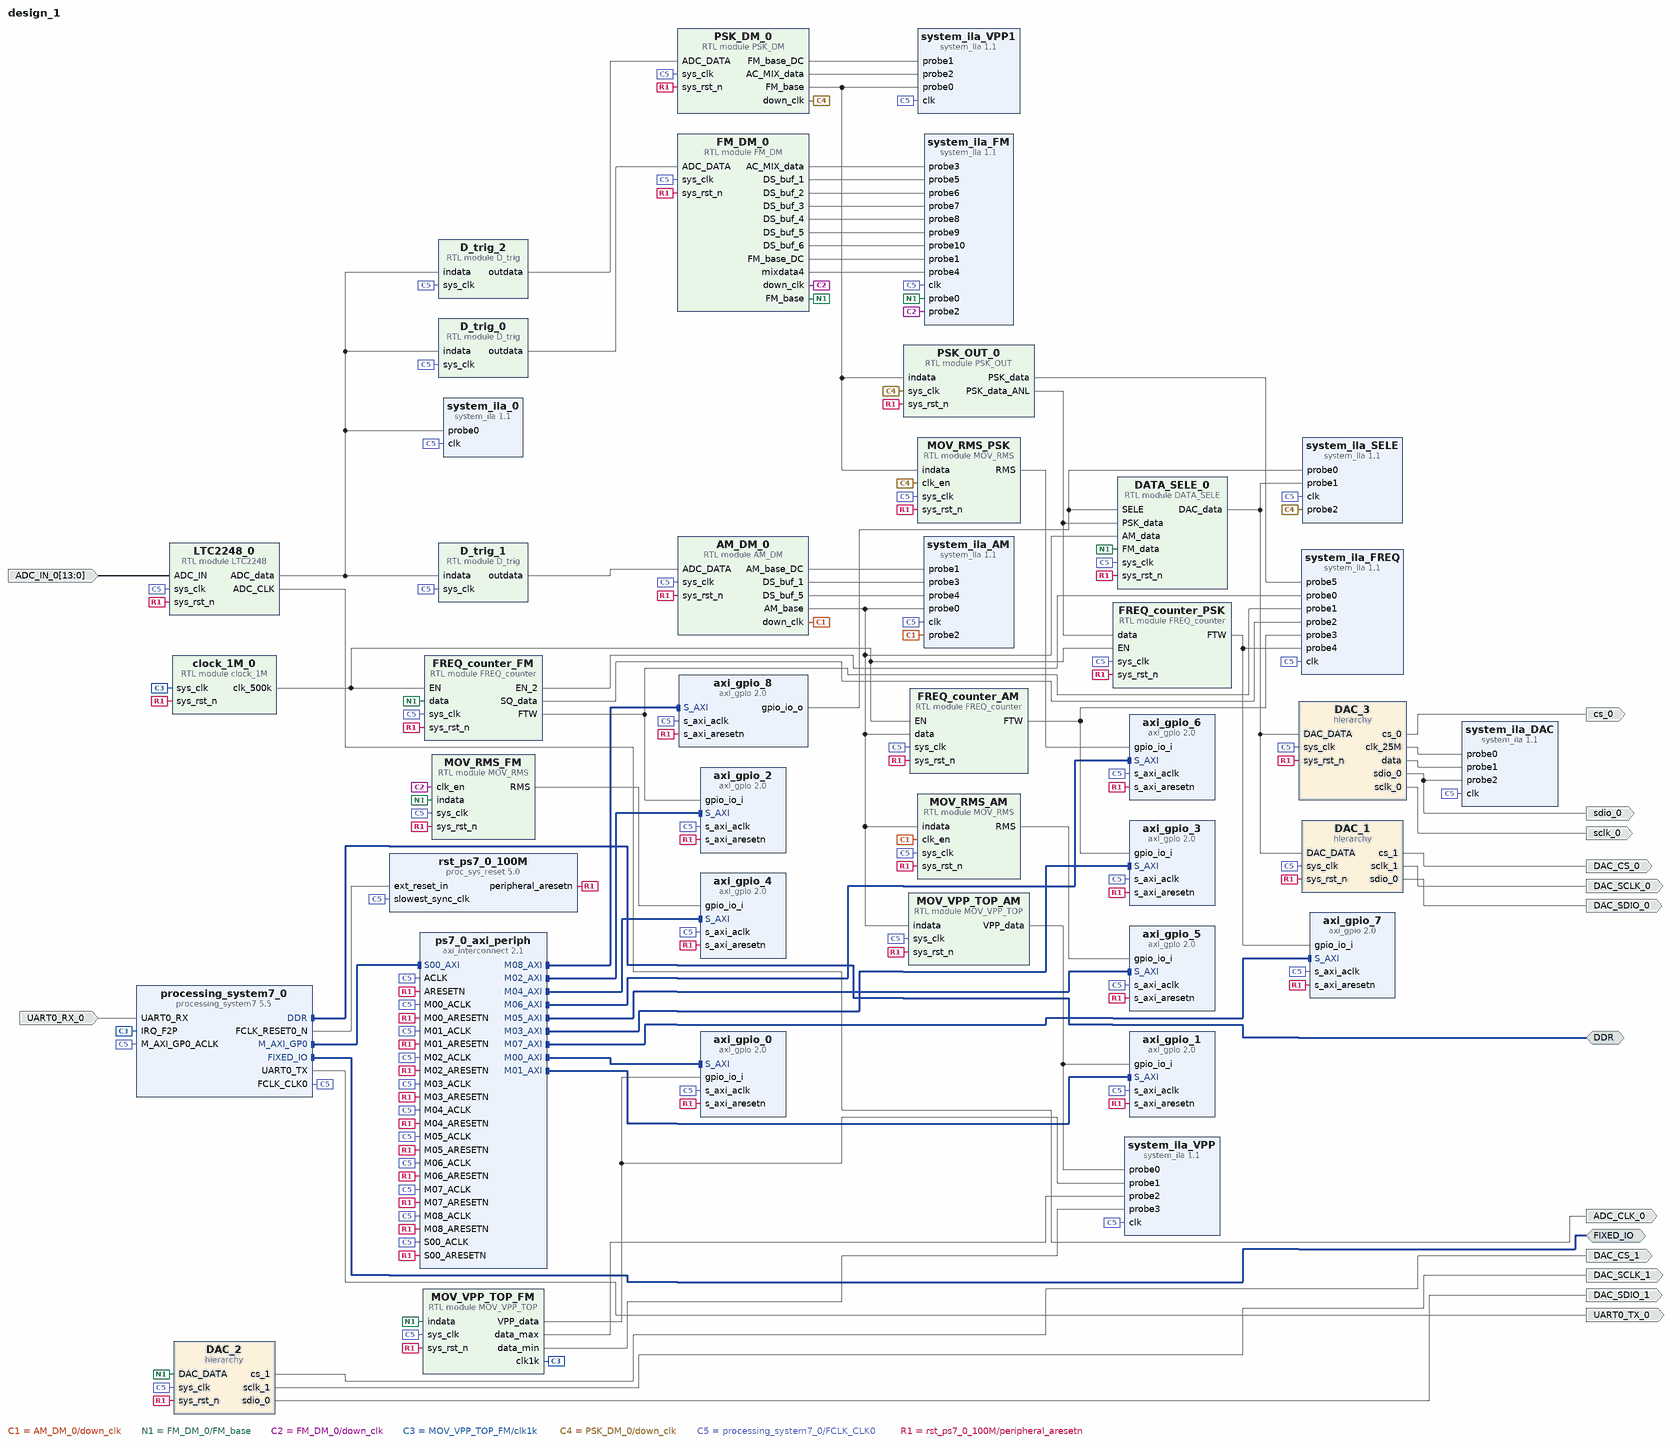
[diagram p0: block diagram of the top level]
# Vivado block design design_1, xc7z035ffg676-2, Vivado 2022.1
create_bd_design design_1

create_bd_intf_port -mode Master -vlnv xilinx.com:interface:ddrx_rtl:1.0 DDR
create_bd_intf_port -mode Master -vlnv xilinx.com:display_processing_system7:fixedio_rtl:1.0 FIXED_IO
create_bd_port -dir O UART0_TX_0
create_bd_port -dir I UART0_RX_0
create_bd_port -dir O DAC_SCLK_0
create_bd_port -dir O DAC_SDIO_0
create_bd_port -dir O DAC_CS_0
create_bd_port -dir O DAC_SCLK_1
create_bd_port -dir O DAC_SDIO_1
create_bd_port -dir O DAC_CS_1
create_bd_port -dir I -from 13 -to 0 ADC_IN_0
create_bd_port -dir O -type clk ADC_CLK_0
create_bd_port -dir O cs_0
create_bd_port -dir O sdio_0
create_bd_port -dir O sclk_0

create_bd_cell -type ip -vlnv xilinx.com:ip:processing_system7:5.5 processing_system7_0
set_property -dict [list \
  CONFIG.PCW_FPGA0_PERIPHERAL_FREQMHZ 100 \
  CONFIG.PCW_IRQ_F2P_INTR 1 \
  CONFIG.PCW_PRESET_BANK1_VOLTAGE {LVCMOS 1.8V} \
  CONFIG.PCW_QSPI_GRP_FBCLK_ENABLE 1 \
  CONFIG.PCW_QSPI_GRP_FBCLK_IO {MIO 8} \
  CONFIG.PCW_QSPI_GRP_SINGLE_SS_ENABLE 1 \
  CONFIG.PCW_QSPI_GRP_SINGLE_SS_IO {MIO 1 .. 6} \
  CONFIG.PCW_QSPI_PERIPHERAL_ENABLE 1 \
  CONFIG.PCW_QSPI_PERIPHERAL_FREQMHZ 125 \
  CONFIG.PCW_QSPI_QSPI_IO {MIO 1 .. 6} \
  CONFIG.PCW_SD0_GRP_CD_ENABLE 1 \
  CONFIG.PCW_SD0_GRP_CD_IO {MIO 47} \
  CONFIG.PCW_SD0_GRP_WP_ENABLE 0 \
  CONFIG.PCW_SD0_PERIPHERAL_ENABLE 1 \
  CONFIG.PCW_SD0_SD0_IO {MIO 40 .. 45} \
  CONFIG.PCW_SDIO_PERIPHERAL_FREQMHZ 50 \
  CONFIG.PCW_SINGLE_QSPI_DATA_MODE x4 \
  CONFIG.PCW_UART0_PERIPHERAL_ENABLE 1 \
  CONFIG.PCW_UART0_UART0_IO EMIO \
  CONFIG.PCW_UART1_PERIPHERAL_ENABLE 0 \
  CONFIG.PCW_UART_PERIPHERAL_FREQMHZ 100 \
  CONFIG.PCW_UIPARAM_DDR_PARTNO {MT41K256M16 RE-125} \
  CONFIG.PCW_USE_FABRIC_INTERRUPT 1 \
] [get_bd_cells processing_system7_0]
# 82 more settings of processing_system7_0 are not shown: defaults, MIO pin electricals, DDR timing, and values the tool derives
create_bd_cell -type ip -vlnv xilinx.com:ip:axi_gpio:2.0 axi_gpio_0
set_property -dict {CONFIG.C_ALL_INPUTS 1 CONFIG.C_GPIO_WIDTH 16} [get_bd_cells axi_gpio_0]
create_bd_cell -type ip -vlnv xilinx.com:ip:axi_interconnect:2.1 ps7_0_axi_periph
set_property -dict {CONFIG.NUM_MI 9} [get_bd_cells ps7_0_axi_periph]
create_bd_cell -type ip -vlnv xilinx.com:ip:proc_sys_reset:5.0 rst_ps7_0_100M
create_bd_cell -type ip -vlnv xilinx.com:ip:axi_gpio:2.0 axi_gpio_1
set_property -dict {CONFIG.C_ALL_INPUTS 1 CONFIG.C_GPIO_WIDTH 16} [get_bd_cells axi_gpio_1]
create_bd_cell -type ip -vlnv xilinx.com:ip:axi_gpio:2.0 axi_gpio_2
set_property -dict {CONFIG.C_ALL_INPUTS 1 CONFIG.C_GPIO_WIDTH 16} [get_bd_cells axi_gpio_2]
create_bd_cell -type ip -vlnv xilinx.com:ip:system_ila:1.1 system_ila_0
set_property -dict [list \
  CONFIG.C_DATA_DEPTH 8192 \
  CONFIG.C_MON_TYPE NATIVE \
  CONFIG.C_NUM_OF_PROBES 1 \
  CONFIG.C_PROBE0_TYPE 0 \
] [get_bd_cells system_ila_0]
create_bd_cell -type ip -vlnv xilinx.com:ip:system_ila:1.1 system_ila_FM
set_property -dict [list \
  CONFIG.ALL_PROBE_SAME_MU_CNT 2 \
  CONFIG.C_DATA_DEPTH 8192 \
  CONFIG.C_EN_STRG_QUAL 1 \
  CONFIG.C_INPUT_PIPE_STAGES 0 \
  CONFIG.C_MON_TYPE NATIVE \
  CONFIG.C_NUM_OF_PROBES 11 \
  CONFIG.C_PROBE0_MU_CNT 2 \
  CONFIG.C_PROBE0_TYPE 0 \
  CONFIG.C_PROBE10_MU_CNT 2 \
  CONFIG.C_PROBE1_MU_CNT 2 \
  CONFIG.C_PROBE2_MU_CNT 2 \
  CONFIG.C_PROBE3_MU_CNT 2 \
  CONFIG.C_PROBE4_MU_CNT 2 \
  CONFIG.C_PROBE5_MU_CNT 2 \
  CONFIG.C_PROBE6_MU_CNT 2 \
  CONFIG.C_PROBE7_MU_CNT 2 \
  CONFIG.C_PROBE8_MU_CNT 2 \
  CONFIG.C_PROBE9_MU_CNT 2 \
] [get_bd_cells system_ila_FM]
create_bd_cell -type module -reference D_trig D_trig_0
create_bd_cell -type module -reference D_trig D_trig_1
create_bd_cell -type ip -vlnv xilinx.com:ip:system_ila:1.1 system_ila_AM
set_property -dict [list \
  CONFIG.ALL_PROBE_SAME_MU_CNT 2 \
  CONFIG.C_DATA_DEPTH 16384 \
  CONFIG.C_EN_STRG_QUAL 1 \
  CONFIG.C_INPUT_PIPE_STAGES 6 \
  CONFIG.C_MON_TYPE NATIVE \
  CONFIG.C_NUM_OF_PROBES 5 \
  CONFIG.C_PROBE0_MU_CNT 2 \
  CONFIG.C_PROBE0_TYPE 0 \
  CONFIG.C_PROBE1_MU_CNT 2 \
  CONFIG.C_PROBE2_MU_CNT 2 \
  CONFIG.C_PROBE3_MU_CNT 2 \
  CONFIG.C_PROBE4_MU_CNT 2 \
] [get_bd_cells system_ila_AM]
create_bd_cell -type hier DAC_1
create_bd_cell -type hier DAC_2
create_bd_cell -type ip -vlnv xilinx.com:ip:system_ila:1.1 system_ila_VPP
set_property -dict [list \
  CONFIG.C_DATA_DEPTH 16384 \
  CONFIG.C_INPUT_PIPE_STAGES 6 \
  CONFIG.C_MON_TYPE NATIVE \
  CONFIG.C_NUM_OF_PROBES 4 \
  CONFIG.C_PROBE0_TYPE 0 \
] [get_bd_cells system_ila_VPP]
create_bd_cell -type module -reference MOV_VPP_TOP MOV_VPP_TOP_AM
create_bd_cell -type module -reference MOV_VPP_TOP MOV_VPP_TOP_FM
create_bd_cell -type module -reference D_trig D_trig_2
create_bd_cell -type ip -vlnv xilinx.com:ip:system_ila:1.1 system_ila_VPP1
set_property -dict [list \
  CONFIG.ALL_PROBE_SAME_MU_CNT 2 \
  CONFIG.C_DATA_DEPTH 16384 \
  CONFIG.C_EN_STRG_QUAL 1 \
  CONFIG.C_INPUT_PIPE_STAGES 0 \
  CONFIG.C_MON_TYPE NATIVE \
  CONFIG.C_NUM_OF_PROBES 4 \
  CONFIG.C_PROBE0_MU_CNT 2 \
  CONFIG.C_PROBE0_TYPE 0 \
  CONFIG.C_PROBE1_MU_CNT 2 \
  CONFIG.C_PROBE2_MU_CNT 2 \
  CONFIG.C_PROBE3_MU_CNT 2 \
] [get_bd_cells system_ila_VPP1]
create_bd_cell -type ip -vlnv xilinx.com:ip:axi_gpio:2.0 axi_gpio_3
set_property -dict {CONFIG.C_ALL_INPUTS 1 CONFIG.C_GPIO_WIDTH 16} [get_bd_cells axi_gpio_3]
create_bd_cell -type ip -vlnv xilinx.com:ip:system_ila:1.1 system_ila_FREQ
set_property -dict [list \
  CONFIG.ALL_PROBE_SAME_MU_CNT 2 \
  CONFIG.C_DATA_DEPTH 16384 \
  CONFIG.C_EN_STRG_QUAL 1 \
  CONFIG.C_INPUT_PIPE_STAGES 0 \
  CONFIG.C_MON_TYPE NATIVE \
  CONFIG.C_NUM_OF_PROBES 6 \
  CONFIG.C_PROBE0_MU_CNT 2 \
  CONFIG.C_PROBE0_TYPE 0 \
  CONFIG.C_PROBE1_MU_CNT 2 \
  CONFIG.C_PROBE2_MU_CNT 2 \
  CONFIG.C_PROBE3_MU_CNT 2 \
  CONFIG.C_PROBE4_MU_CNT 2 \
  CONFIG.C_PROBE5_MU_CNT 2 \
] [get_bd_cells system_ila_FREQ]
create_bd_cell -type module -reference FREQ_counter FREQ_counter_FM
set_property -dict {CONFIG.HIGH 100 CONFIG.LOW -100} [get_bd_cells FREQ_counter_FM]
create_bd_cell -type module -reference FREQ_counter FREQ_counter_AM
set_property -dict {CONFIG.HIGH 400 CONFIG.LOW -400} [get_bd_cells FREQ_counter_AM]
create_bd_cell -type module -reference clock_1M clock_1M_0
set_property -dict {CONFIG.cont 2} [get_bd_cells clock_1M_0]
create_bd_cell -type module -reference LTC2248 LTC2248_0
create_bd_cell -type ip -vlnv xilinx.com:ip:axi_gpio:2.0 axi_gpio_4
set_property -dict {CONFIG.C_ALL_INPUTS 1 CONFIG.C_GPIO_WIDTH 16} [get_bd_cells axi_gpio_4]
create_bd_cell -type ip -vlnv xilinx.com:ip:axi_gpio:2.0 axi_gpio_5
set_property -dict {CONFIG.C_ALL_INPUTS 1 CONFIG.C_GPIO_WIDTH 16} [get_bd_cells axi_gpio_5]
create_bd_cell -type ip -vlnv xilinx.com:ip:axi_gpio:2.0 axi_gpio_6
set_property -dict {CONFIG.C_ALL_INPUTS 1 CONFIG.C_GPIO_WIDTH 16} [get_bd_cells axi_gpio_6]
create_bd_cell -type module -reference FREQ_counter FREQ_counter_PSK
set_property -dict {CONFIG.HIGH 50 CONFIG.LOW -50} [get_bd_cells FREQ_counter_PSK]
create_bd_cell -type ip -vlnv xilinx.com:ip:axi_gpio:2.0 axi_gpio_7
set_property -dict {CONFIG.C_ALL_INPUTS 1 CONFIG.C_GPIO_WIDTH 16} [get_bd_cells axi_gpio_7]
create_bd_cell -type module -reference PSK_OUT PSK_OUT_0
create_bd_cell -type ip -vlnv xilinx.com:ip:axi_gpio:2.0 axi_gpio_8
set_property -dict {CONFIG.C_ALL_INPUTS 0 CONFIG.C_ALL_OUTPUTS 1 CONFIG.C_GPIO_WIDTH 16} [get_bd_cells axi_gpio_8]
create_bd_cell -type module -reference DATA_SELE DATA_SELE_0
create_bd_cell -type ip -vlnv xilinx.com:ip:system_ila:1.1 system_ila_SELE
set_property -dict [list \
  CONFIG.ALL_PROBE_SAME_MU_CNT 2 \
  CONFIG.C_DATA_DEPTH 8192 \
  CONFIG.C_EN_STRG_QUAL 1 \
  CONFIG.C_INPUT_PIPE_STAGES 0 \
  CONFIG.C_MON_TYPE NATIVE \
  CONFIG.C_NUM_OF_PROBES 3 \
  CONFIG.C_PROBE0_MU_CNT 2 \
  CONFIG.C_PROBE0_TYPE 0 \
  CONFIG.C_PROBE1_MU_CNT 2 \
  CONFIG.C_PROBE2_MU_CNT 2 \
] [get_bd_cells system_ila_SELE]
create_bd_cell -type module -reference AM_DM AM_DM_0
create_bd_cell -type module -reference MOV_RMS MOV_RMS_AM
set_property -dict {CONFIG.ADD_DW 35 CONFIG.DIV_BIT 12 CONFIG.WIDTH 3125} [get_bd_cells MOV_RMS_AM]
create_bd_cell -type module -reference MOV_RMS MOV_RMS_FM
set_property -dict {CONFIG.ADD_DW 35 CONFIG.DIV_BIT 12 CONFIG.WIDTH 3125} [get_bd_cells MOV_RMS_FM]
create_bd_cell -type module -reference MOV_RMS MOV_RMS_PSK
set_property -dict {CONFIG.ADD_DW 35 CONFIG.DIV_BIT 12 CONFIG.WIDTH 3125} [get_bd_cells MOV_RMS_PSK]
create_bd_cell -type module -reference FM_DM FM_DM_0
create_bd_cell -type module -reference PSK_DM PSK_DM_0
create_bd_cell -type hier DAC_3
create_bd_cell -type ip -vlnv xilinx.com:ip:system_ila:1.1 system_ila_DAC
set_property -dict [list \
  CONFIG.ALL_PROBE_SAME_MU_CNT 2 \
  CONFIG.C_DATA_DEPTH 8192 \
  CONFIG.C_EN_STRG_QUAL 1 \
  CONFIG.C_INPUT_PIPE_STAGES 0 \
  CONFIG.C_MON_TYPE NATIVE \
  CONFIG.C_NUM_OF_PROBES 3 \
  CONFIG.C_PROBE0_MU_CNT 2 \
  CONFIG.C_PROBE0_TYPE 0 \
  CONFIG.C_PROBE1_MU_CNT 2 \
  CONFIG.C_PROBE2_MU_CNT 2 \
] [get_bd_cells system_ila_DAC]

# ---- hierarchy /DAC_1 ----
current_bd_instance /DAC_1
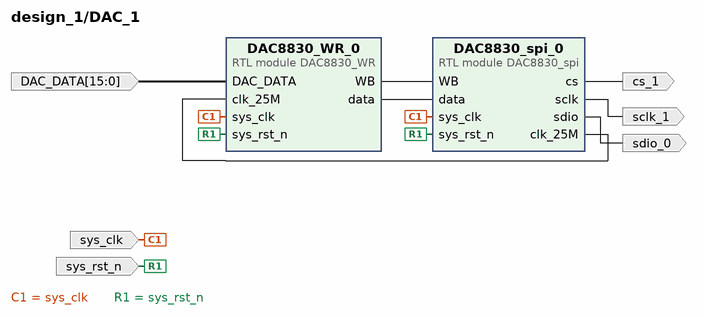
[diagram p1: block diagram inside /DAC_1]
create_bd_pin -dir I -type clk sys_clk
create_bd_pin -dir I -type rst sys_rst_n
create_bd_pin -dir I -from 15 -to 0 DAC_DATA
create_bd_pin -dir O sclk_1
create_bd_pin -dir O sdio_0
create_bd_pin -dir O cs_1

create_bd_cell -type module -reference DAC8830_WR DAC8830_WR_0
create_bd_cell -type module -reference DAC8830_spi DAC8830_spi_0

# ---- hierarchy /DAC_2 ----
current_bd_instance /DAC_2
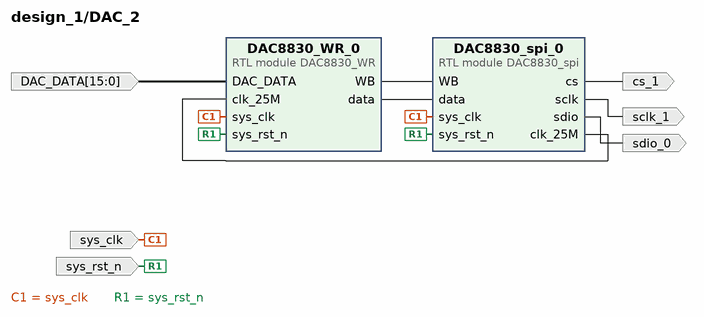
[diagram p2: block diagram inside /DAC_2]
create_bd_pin -dir I -type clk sys_clk
create_bd_pin -dir I -type rst sys_rst_n
create_bd_pin -dir I -from 15 -to 0 DAC_DATA
create_bd_pin -dir O sclk_1
create_bd_pin -dir O sdio_0
create_bd_pin -dir O cs_1

create_bd_cell -type module -reference DAC8830_WR DAC8830_WR_0
create_bd_cell -type module -reference DAC8830_spi DAC8830_spi_0

# ---- hierarchy /DAC_3 ----
current_bd_instance /DAC_3
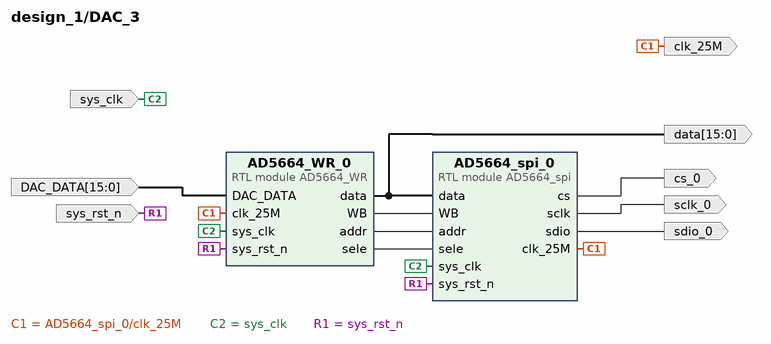
[diagram p3: block diagram inside /DAC_3]
create_bd_pin -dir I -type clk sys_clk
create_bd_pin -dir I -type rst sys_rst_n
create_bd_pin -dir I -from 15 -to 0 DAC_DATA
create_bd_pin -dir O sclk_0
create_bd_pin -dir O sdio_0
create_bd_pin -dir O cs_0
create_bd_pin -dir O clk_25M
create_bd_pin -dir O -from 15 -to 0 data

create_bd_cell -type module -reference AD5664_spi AD5664_spi_0
create_bd_cell -type module -reference AD5664_WR AD5664_WR_0
set_property -dict {CONFIG.sele_ch 1} [get_bd_cells AD5664_WR_0]

# ---- connections ----

current_bd_instance /DAC_1
connect_bd_net [get_bd_pins DAC8830_WR_0/WB] [get_bd_pins DAC8830_spi_0/WB]
connect_bd_net [get_bd_pins DAC8830_WR_0/data] [get_bd_pins DAC8830_spi_0/data]
connect_bd_net [get_bd_pins DAC8830_spi_0/clk_25M] [get_bd_pins DAC8830_WR_0/clk_25M]
connect_bd_net [get_bd_pins DAC8830_spi_0/cs] [get_bd_pins cs_1]
connect_bd_net [get_bd_pins DAC8830_spi_0/sclk] [get_bd_pins sclk_1]
connect_bd_net [get_bd_pins DAC8830_spi_0/sdio] [get_bd_pins sdio_0]
connect_bd_net [get_bd_pins DAC_DATA] [get_bd_pins DAC8830_WR_0/DAC_DATA]
connect_bd_net -net processing_system7_0_FCLK_CLK0 [get_bd_pins sys_clk] [get_bd_pins DAC8830_spi_0/sys_clk] [get_bd_pins DAC8830_WR_0/sys_clk]
connect_bd_net -net rst_ps7_0_100M_peripheral_aresetn [get_bd_pins sys_rst_n] \
  [get_bd_pins DAC8830_spi_0/sys_rst_n] [get_bd_pins DAC8830_WR_0/sys_rst_n]

current_bd_instance /DAC_2
connect_bd_net [get_bd_pins DAC8830_WR_0/WB] [get_bd_pins DAC8830_spi_0/WB]
connect_bd_net [get_bd_pins DAC8830_WR_0/data] [get_bd_pins DAC8830_spi_0/data]
connect_bd_net [get_bd_pins DAC8830_spi_0/clk_25M] [get_bd_pins DAC8830_WR_0/clk_25M]
connect_bd_net [get_bd_pins DAC8830_spi_0/cs] [get_bd_pins cs_1]
connect_bd_net [get_bd_pins DAC8830_spi_0/sclk] [get_bd_pins sclk_1]
connect_bd_net [get_bd_pins DAC8830_spi_0/sdio] [get_bd_pins sdio_0]
connect_bd_net [get_bd_pins DAC_DATA] [get_bd_pins DAC8830_WR_0/DAC_DATA]
connect_bd_net -net processing_system7_0_FCLK_CLK0 [get_bd_pins sys_clk] [get_bd_pins DAC8830_spi_0/sys_clk] [get_bd_pins DAC8830_WR_0/sys_clk]
connect_bd_net -net rst_ps7_0_100M_peripheral_aresetn [get_bd_pins sys_rst_n] \
  [get_bd_pins DAC8830_spi_0/sys_rst_n] [get_bd_pins DAC8830_WR_0/sys_rst_n]

current_bd_instance /DAC_3
connect_bd_net [get_bd_pins AD5664_WR_0/WB] [get_bd_pins AD5664_spi_0/WB]
connect_bd_net [get_bd_pins AD5664_WR_0/addr] [get_bd_pins AD5664_spi_0/addr]
connect_bd_net [get_bd_pins AD5664_WR_0/data] [get_bd_pins AD5664_spi_0/data] [get_bd_pins data]
connect_bd_net [get_bd_pins AD5664_WR_0/sele] [get_bd_pins AD5664_spi_0/sele]
connect_bd_net [get_bd_pins AD5664_spi_0/clk_25M] [get_bd_pins clk_25M] [get_bd_pins AD5664_WR_0/clk_25M]
connect_bd_net [get_bd_pins AD5664_spi_0/cs] [get_bd_pins cs_0]
connect_bd_net [get_bd_pins AD5664_spi_0/sclk] [get_bd_pins sclk_0]
connect_bd_net [get_bd_pins AD5664_spi_0/sdio] [get_bd_pins sdio_0]
connect_bd_net -net DATA_SELE_0_DAC_data [get_bd_pins DAC_DATA] [get_bd_pins AD5664_WR_0/DAC_DATA]
connect_bd_net -net processing_system7_0_FCLK_CLK0 [get_bd_pins sys_clk] [get_bd_pins AD5664_spi_0/sys_clk] [get_bd_pins AD5664_WR_0/sys_clk]
connect_bd_net -net rst_ps7_0_100M_peripheral_aresetn [get_bd_pins sys_rst_n] [get_bd_pins AD5664_spi_0/sys_rst_n] [get_bd_pins AD5664_WR_0/sys_rst_n]

current_bd_instance /
connect_bd_intf_net [get_bd_intf_ports DDR] [get_bd_intf_pins processing_system7_0/DDR]
connect_bd_intf_net [get_bd_intf_ports FIXED_IO] [get_bd_intf_pins processing_system7_0/FIXED_IO]
connect_bd_intf_net [get_bd_intf_pins processing_system7_0/M_AXI_GP0] [get_bd_intf_pins ps7_0_axi_periph/S00_AXI]
connect_bd_intf_net [get_bd_intf_pins ps7_0_axi_periph/M00_AXI] [get_bd_intf_pins axi_gpio_0/S_AXI]
connect_bd_intf_net [get_bd_intf_pins ps7_0_axi_periph/M01_AXI] [get_bd_intf_pins axi_gpio_1/S_AXI]
connect_bd_intf_net [get_bd_intf_pins ps7_0_axi_periph/M02_AXI] [get_bd_intf_pins axi_gpio_2/S_AXI]
connect_bd_intf_net [get_bd_intf_pins ps7_0_axi_periph/M03_AXI] [get_bd_intf_pins axi_gpio_3/S_AXI]
connect_bd_intf_net [get_bd_intf_pins ps7_0_axi_periph/M04_AXI] [get_bd_intf_pins axi_gpio_4/S_AXI]
connect_bd_intf_net [get_bd_intf_pins ps7_0_axi_periph/M05_AXI] [get_bd_intf_pins axi_gpio_5/S_AXI]
connect_bd_intf_net [get_bd_intf_pins ps7_0_axi_periph/M06_AXI] [get_bd_intf_pins axi_gpio_6/S_AXI]
connect_bd_intf_net [get_bd_intf_pins ps7_0_axi_periph/M07_AXI] [get_bd_intf_pins axi_gpio_7/S_AXI]
connect_bd_intf_net [get_bd_intf_pins ps7_0_axi_periph/M08_AXI] [get_bd_intf_pins axi_gpio_8/S_AXI]
connect_bd_net -net AD5664_spi_0_cs [get_bd_pins DAC_3/cs_0] [get_bd_ports cs_0]
connect_bd_net -net AD5664_spi_0_sclk [get_bd_pins DAC_3/sclk_0] [get_bd_ports sclk_0]
connect_bd_net -net AD5664_spi_0_sdio [get_bd_pins DAC_3/sdio_0] [get_bd_ports sdio_0] [get_bd_pins system_ila_DAC/probe2]
connect_bd_net -net AD9434_0_adc_data [get_bd_pins LTC2248_0/ADC_data] \
  [get_bd_pins D_trig_0/indata] [get_bd_pins D_trig_1/indata] [get_bd_pins D_trig_2/indata] [get_bd_pins system_ila_0/probe0]
connect_bd_net -net ADC_IN_0_1 [get_bd_ports ADC_IN_0] [get_bd_pins LTC2248_0/ADC_IN]
connect_bd_net [get_bd_pins AM_DM_0/AM_base] \
  [get_bd_pins MOV_VPP_TOP_AM/indata] [get_bd_pins FREQ_counter_AM/data] [get_bd_pins system_ila_AM/probe0] \
  [get_bd_pins DATA_SELE_0/AM_data] [get_bd_pins MOV_RMS_AM/indata]
connect_bd_net [get_bd_pins AM_DM_0/AM_base_DC] [get_bd_pins system_ila_AM/probe1]
connect_bd_net [get_bd_pins AM_DM_0/DS_buf_1] [get_bd_pins system_ila_AM/probe3]
connect_bd_net [get_bd_pins AM_DM_0/DS_buf_5] [get_bd_pins system_ila_AM/probe4]
connect_bd_net [get_bd_pins AM_DM_0/down_clk] [get_bd_pins system_ila_AM/probe2] [get_bd_pins MOV_RMS_AM/clk_en]
connect_bd_net [get_bd_pins DAC_1/cs_1] [get_bd_ports DAC_CS_0]
connect_bd_net [get_bd_pins DAC_1/sclk_1] [get_bd_ports DAC_SCLK_0]
connect_bd_net [get_bd_pins DAC_1/sdio_0] [get_bd_ports DAC_SDIO_0]
connect_bd_net [get_bd_pins DAC_2/cs_1] [get_bd_ports DAC_CS_1]
connect_bd_net [get_bd_pins DAC_2/sclk_1] [get_bd_ports DAC_SCLK_1]
connect_bd_net [get_bd_pins DAC_2/sdio_0] [get_bd_ports DAC_SDIO_1]
connect_bd_net [get_bd_pins DAC_3/clk_25M] [get_bd_pins system_ila_DAC/probe0]
connect_bd_net [get_bd_pins DAC_3/data] [get_bd_pins system_ila_DAC/probe1]
connect_bd_net [get_bd_pins DATA_SELE_0/DAC_data] [get_bd_pins DAC_1/DAC_DATA] [get_bd_pins system_ila_SELE/probe1] [get_bd_pins DAC_3/DAC_DATA]
connect_bd_net [get_bd_pins D_trig_0/outdata] [get_bd_pins FM_DM_0/ADC_DATA]
connect_bd_net [get_bd_pins D_trig_1/outdata] [get_bd_pins AM_DM_0/ADC_DATA]
connect_bd_net [get_bd_pins D_trig_2/outdata] [get_bd_pins PSK_DM_0/ADC_DATA]
connect_bd_net [get_bd_pins FM_DM_0/AC_MIX_data] [get_bd_pins system_ila_FM/probe3]
connect_bd_net [get_bd_pins FM_DM_0/DS_buf_1] [get_bd_pins system_ila_FM/probe5]
connect_bd_net [get_bd_pins FM_DM_0/DS_buf_2] [get_bd_pins system_ila_FM/probe6]
connect_bd_net [get_bd_pins FM_DM_0/DS_buf_3] [get_bd_pins system_ila_FM/probe7]
connect_bd_net [get_bd_pins FM_DM_0/DS_buf_4] [get_bd_pins system_ila_FM/probe8]
connect_bd_net [get_bd_pins FM_DM_0/DS_buf_5] [get_bd_pins system_ila_FM/probe9]
connect_bd_net [get_bd_pins FM_DM_0/DS_buf_6] [get_bd_pins system_ila_FM/probe10]
connect_bd_net [get_bd_pins FM_DM_0/FM_base] \
  [get_bd_pins MOV_VPP_TOP_FM/indata] [get_bd_pins system_ila_FM/probe0] [get_bd_pins DAC_2/DAC_DATA] \
  [get_bd_pins FREQ_counter_FM/data] [get_bd_pins DATA_SELE_0/FM_data] [get_bd_pins MOV_RMS_FM/indata]
connect_bd_net [get_bd_pins FM_DM_0/FM_base_DC] [get_bd_pins system_ila_FM/probe1]
connect_bd_net [get_bd_pins FM_DM_0/down_clk] [get_bd_pins system_ila_FM/probe2] [get_bd_pins MOV_RMS_FM/clk_en]
connect_bd_net [get_bd_pins FM_DM_0/mixdata4] [get_bd_pins system_ila_FM/probe4]
connect_bd_net -net FREQ_counter_0_FTW [get_bd_pins FREQ_counter_FM/FTW] [get_bd_pins axi_gpio_2/gpio_io_i] [get_bd_pins system_ila_FREQ/probe1]
connect_bd_net [get_bd_pins FREQ_counter_AM/FTW] [get_bd_pins axi_gpio_3/gpio_io_i] [get_bd_pins system_ila_FREQ/probe3]
connect_bd_net -net FREQ_counter_FM1_FTW [get_bd_pins FREQ_counter_PSK/FTW] [get_bd_pins system_ila_FREQ/probe4] [get_bd_pins axi_gpio_7/gpio_io_i]
connect_bd_net [get_bd_pins FREQ_counter_FM/EN_2] [get_bd_pins system_ila_FREQ/probe0]
connect_bd_net [get_bd_pins FREQ_counter_FM/SQ_data] [get_bd_pins system_ila_FREQ/probe2]
connect_bd_net [get_bd_pins LTC2248_0/ADC_CLK] [get_bd_ports ADC_CLK_0]
connect_bd_net [get_bd_pins MOV_RMS_AM/RMS] [get_bd_pins axi_gpio_5/gpio_io_i]
connect_bd_net [get_bd_pins MOV_RMS_FM/RMS] [get_bd_pins axi_gpio_4/gpio_io_i]
connect_bd_net [get_bd_pins MOV_RMS_PSK/RMS] [get_bd_pins axi_gpio_6/gpio_io_i]
connect_bd_net [get_bd_pins MOV_VPP_TOP_AM/VPP_data] [get_bd_pins system_ila_VPP/probe0] [get_bd_pins axi_gpio_1/gpio_io_i]
connect_bd_net [get_bd_pins MOV_VPP_TOP_FM/VPP_data] [get_bd_pins system_ila_VPP/probe1] [get_bd_pins axi_gpio_0/gpio_io_i]
connect_bd_net [get_bd_pins MOV_VPP_TOP_FM/clk1k] [get_bd_pins processing_system7_0/IRQ_F2P] [get_bd_pins clock_1M_0/sys_clk]
connect_bd_net [get_bd_pins MOV_VPP_TOP_FM/data_max] [get_bd_pins system_ila_VPP/probe2]
connect_bd_net [get_bd_pins MOV_VPP_TOP_FM/data_min] [get_bd_pins system_ila_VPP/probe3]
connect_bd_net [get_bd_pins PSK_DM_0/FM_base] [get_bd_pins system_ila_VPP1/probe0] [get_bd_pins PSK_OUT_0/indata] [get_bd_pins MOV_RMS_PSK/indata]
connect_bd_net [get_bd_pins PSK_DM_0/FM_base_DC] [get_bd_pins system_ila_VPP1/probe1]
connect_bd_net [get_bd_pins PSK_DM_0/down_clk] [get_bd_pins PSK_OUT_0/sys_clk] [get_bd_pins system_ila_SELE/probe2] [get_bd_pins MOV_RMS_PSK/clk_en]
connect_bd_net -net PSK_DM_0_mixdata4 [get_bd_pins PSK_DM_0/AC_MIX_data] [get_bd_pins system_ila_VPP1/probe2]
connect_bd_net [get_bd_pins PSK_OUT_0/PSK_data] [get_bd_pins system_ila_FREQ/probe5]
connect_bd_net [get_bd_pins PSK_OUT_0/PSK_data_ANL] [get_bd_pins FREQ_counter_PSK/data] [get_bd_pins DATA_SELE_0/PSK_data]
connect_bd_net -net UART0_RX_0_1 [get_bd_ports UART0_RX_0] [get_bd_pins processing_system7_0/UART0_RX]
connect_bd_net [get_bd_pins axi_gpio_8/gpio_io_o] [get_bd_pins DATA_SELE_0/SELE] [get_bd_pins system_ila_SELE/probe0]
connect_bd_net [get_bd_pins clock_1M_0/clk_500k] [get_bd_pins FREQ_counter_FM/EN] [get_bd_pins FREQ_counter_AM/EN] [get_bd_pins FREQ_counter_PSK/EN]
connect_bd_net [get_bd_pins processing_system7_0/FCLK_CLK0] \
  [get_bd_pins processing_system7_0/M_AXI_GP0_ACLK] [get_bd_pins ps7_0_axi_periph/S00_ACLK] \
  [get_bd_pins rst_ps7_0_100M/slowest_sync_clk] [get_bd_pins axi_gpio_0/s_axi_aclk] [get_bd_pins ps7_0_axi_periph/M00_ACLK] \
  [get_bd_pins ps7_0_axi_periph/ACLK] [get_bd_pins axi_gpio_1/s_axi_aclk] [get_bd_pins ps7_0_axi_periph/M01_ACLK] \
  [get_bd_pins axi_gpio_2/s_axi_aclk] [get_bd_pins ps7_0_axi_periph/M02_ACLK] [get_bd_pins system_ila_0/clk] \
  [get_bd_pins system_ila_FM/clk] [get_bd_pins D_trig_1/sys_clk] [get_bd_pins D_trig_0/sys_clk] \
  [get_bd_pins system_ila_AM/clk] [get_bd_pins DAC_1/sys_clk] [get_bd_pins DAC_2/sys_clk] [get_bd_pins system_ila_VPP/clk] \
  [get_bd_pins MOV_VPP_TOP_AM/sys_clk] [get_bd_pins MOV_VPP_TOP_FM/sys_clk] [get_bd_pins D_trig_2/sys_clk] \
  [get_bd_pins system_ila_VPP1/clk] [get_bd_pins axi_gpio_3/s_axi_aclk] [get_bd_pins ps7_0_axi_periph/M03_ACLK] \
  [get_bd_pins system_ila_FREQ/clk] [get_bd_pins FREQ_counter_FM/sys_clk] [get_bd_pins FREQ_counter_AM/sys_clk] \
  [get_bd_pins LTC2248_0/sys_clk] [get_bd_pins axi_gpio_4/s_axi_aclk] [get_bd_pins ps7_0_axi_periph/M04_ACLK] \
  [get_bd_pins axi_gpio_5/s_axi_aclk] [get_bd_pins ps7_0_axi_periph/M05_ACLK] [get_bd_pins axi_gpio_6/s_axi_aclk] \
  [get_bd_pins ps7_0_axi_periph/M06_ACLK] [get_bd_pins FREQ_counter_PSK/sys_clk] [get_bd_pins axi_gpio_7/s_axi_aclk] \
  [get_bd_pins ps7_0_axi_periph/M07_ACLK] [get_bd_pins axi_gpio_8/s_axi_aclk] [get_bd_pins ps7_0_axi_periph/M08_ACLK] \
  [get_bd_pins DATA_SELE_0/sys_clk] [get_bd_pins system_ila_SELE/clk] [get_bd_pins AM_DM_0/sys_clk] \
  [get_bd_pins MOV_RMS_AM/sys_clk] [get_bd_pins MOV_RMS_FM/sys_clk] [get_bd_pins MOV_RMS_PSK/sys_clk] \
  [get_bd_pins FM_DM_0/sys_clk] [get_bd_pins PSK_DM_0/sys_clk] [get_bd_pins DAC_3/sys_clk] [get_bd_pins system_ila_DAC/clk]
connect_bd_net [get_bd_pins processing_system7_0/FCLK_RESET0_N] [get_bd_pins rst_ps7_0_100M/ext_reset_in]
connect_bd_net [get_bd_pins processing_system7_0/UART0_TX] [get_bd_ports UART0_TX_0]
connect_bd_net [get_bd_pins rst_ps7_0_100M/peripheral_aresetn] \
  [get_bd_pins ps7_0_axi_periph/S00_ARESETN] [get_bd_pins axi_gpio_0/s_axi_aresetn] \
  [get_bd_pins ps7_0_axi_periph/M00_ARESETN] [get_bd_pins ps7_0_axi_periph/ARESETN] [get_bd_pins axi_gpio_1/s_axi_aresetn] \
  [get_bd_pins ps7_0_axi_periph/M01_ARESETN] [get_bd_pins axi_gpio_2/s_axi_aresetn] \
  [get_bd_pins ps7_0_axi_periph/M02_ARESETN] [get_bd_pins DAC_1/sys_rst_n] [get_bd_pins DAC_2/sys_rst_n] \
  [get_bd_pins MOV_VPP_TOP_AM/sys_rst_n] [get_bd_pins MOV_VPP_TOP_FM/sys_rst_n] [get_bd_pins axi_gpio_3/s_axi_aresetn] \
  [get_bd_pins ps7_0_axi_periph/M03_ARESETN] [get_bd_pins FREQ_counter_FM/sys_rst_n] [get_bd_pins FREQ_counter_AM/sys_rst_n] \
  [get_bd_pins clock_1M_0/sys_rst_n] [get_bd_pins LTC2248_0/sys_rst_n] [get_bd_pins axi_gpio_4/s_axi_aresetn] \
  [get_bd_pins ps7_0_axi_periph/M04_ARESETN] [get_bd_pins axi_gpio_5/s_axi_aresetn] \
  [get_bd_pins ps7_0_axi_periph/M05_ARESETN] [get_bd_pins axi_gpio_6/s_axi_aresetn] \
  [get_bd_pins ps7_0_axi_periph/M06_ARESETN] [get_bd_pins FREQ_counter_PSK/sys_rst_n] [get_bd_pins axi_gpio_7/s_axi_aresetn] \
  [get_bd_pins ps7_0_axi_periph/M07_ARESETN] [get_bd_pins PSK_OUT_0/sys_rst_n] [get_bd_pins axi_gpio_8/s_axi_aresetn] \
  [get_bd_pins ps7_0_axi_periph/M08_ARESETN] [get_bd_pins DATA_SELE_0/sys_rst_n] [get_bd_pins AM_DM_0/sys_rst_n] \
  [get_bd_pins MOV_RMS_AM/sys_rst_n] [get_bd_pins MOV_RMS_FM/sys_rst_n] [get_bd_pins MOV_RMS_PSK/sys_rst_n] \
  [get_bd_pins FM_DM_0/sys_rst_n] [get_bd_pins PSK_DM_0/sys_rst_n] [get_bd_pins DAC_3/sys_rst_n]

# ---- address map ----
assign_bd_address -offset 0x41200000 -range 64K -target_address_space [get_bd_addr_spaces processing_system7_0/Data] [get_bd_addr_segs axi_gpio_0/S_AXI/Reg]
assign_bd_address -offset 0x41210000 -range 64K -target_address_space [get_bd_addr_spaces processing_system7_0/Data] [get_bd_addr_segs axi_gpio_1/S_AXI/Reg]
assign_bd_address -offset 0x41220000 -range 64K -target_address_space [get_bd_addr_spaces processing_system7_0/Data] [get_bd_addr_segs axi_gpio_2/S_AXI/Reg]
assign_bd_address -offset 0x41230000 -range 64K -target_address_space [get_bd_addr_spaces processing_system7_0/Data] [get_bd_addr_segs axi_gpio_3/S_AXI/Reg]
assign_bd_address -offset 0x41240000 -range 64K -target_address_space [get_bd_addr_spaces processing_system7_0/Data] [get_bd_addr_segs axi_gpio_4/S_AXI/Reg]
assign_bd_address -offset 0x41250000 -range 64K -target_address_space [get_bd_addr_spaces processing_system7_0/Data] [get_bd_addr_segs axi_gpio_5/S_AXI/Reg]
assign_bd_address -offset 0x41260000 -range 64K -target_address_space [get_bd_addr_spaces processing_system7_0/Data] [get_bd_addr_segs axi_gpio_6/S_AXI/Reg]
assign_bd_address -offset 0x41270000 -range 64K -target_address_space [get_bd_addr_spaces processing_system7_0/Data] [get_bd_addr_segs axi_gpio_7/S_AXI/Reg]
assign_bd_address -offset 0x41280000 -range 64K -target_address_space [get_bd_addr_spaces processing_system7_0/Data] [get_bd_addr_segs axi_gpio_8/S_AXI/Reg]

validate_bd_design
save_bd_design
